# Altium project FPGA_SHIELD_MARK1.PrjPcb
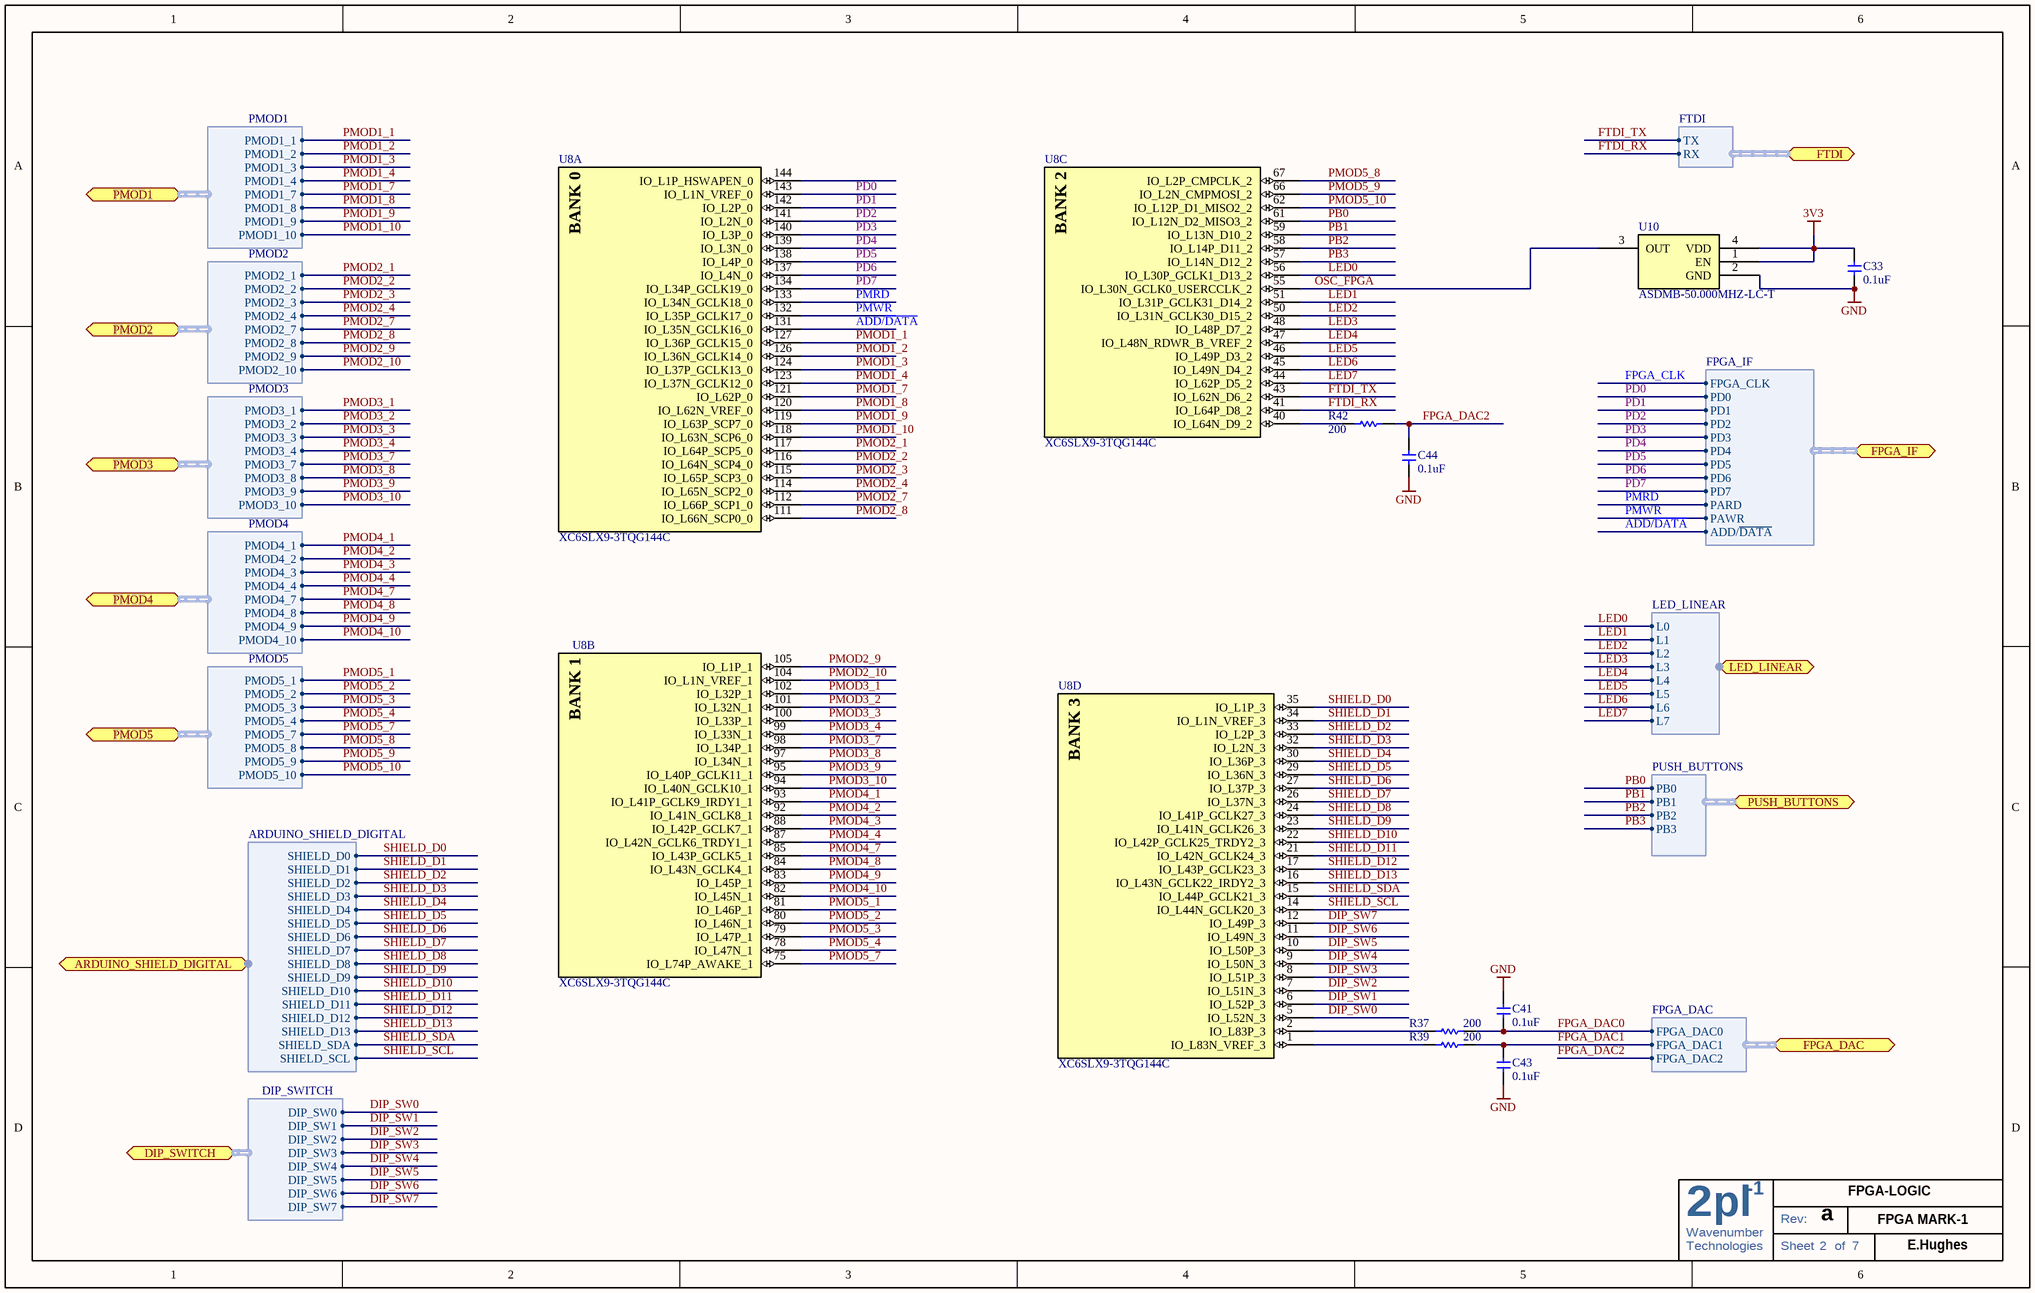
[diagram p0: LOGIC_FPGA.SchDoc]
Engineer: MJ/EH; PCB_TITLE: FPGA Mark 1; PCB_VERSION: a
4 sheets, 60 parts. Net scope: flat (ports and power ports of the same name join across sheets).
Board file: FPGA_SHIELD_MARK1_Single_Side.PcbDoc
Sheets:
  LOGIC_FPGA.SchDoc
  FPGA_POWER_AND_CONFIGURATION.SchDoc
  PMOD_IO.SchDoc
  ARDUINO_IO.SchDoc

## Sheet LOGIC_FPGA.SchDoc: FPGA Logic
size B; Author: Michael Jones; Engineer: Michael Jones; Organization: Group VIII Technology; Address1: 1652 W 820 N; Address2: Provo; Address3: UT  84601; Address4: 801-379-0118; DocumentNumber: 3; Revision: A3; SheetNumber: 2; SheetTotal: 7

### Parts
C33  0.1uF  [C0603]
C41  0.1uF  [C0603]
C43  0.1uF  [C0603]
C44  0.1uF  [C0603]
R37  200  [R0603]
R39  200  [R0603]
R42  200  [R0603]
U8  XC6SLX9-3TQG144C  [TQ144_L]  (parts A,B,C,D of 7)
U10  ASDMB-50.000MHZ-LC-T  [ASDMB - osc]

### Ports
ARDUINO_SHIELD_DIGITAL (harness ARDUINO_SHIELD_DIGITAL), DIP_SWITCH (harness DIP_SWITCH), FPGA_DAC (harness FPGA_DAC), FPGA_IF (harness FPGA_IF), FTDI (harness FTDI), LED_LINEAR (harness LED_LINEAR), PMOD1 (harness PMOD1), PMOD2 (harness PMOD2), PMOD3 (harness PMOD3), PMOD4 (harness PMOD4), PMOD5 (harness PMOD5), PUSH_BUTTONS (harness PUSH_BUTTONS)

### Harnesses
DIP_SWITCH: DIP_SW0, DIP_SW1, DIP_SW2, DIP_SW3, DIP_SW4, DIP_SW5, DIP_SW6, DIP_SW7
ARDUINO_SHIELD_DIGITAL: SHIELD_D13, SHIELD_D12, SHIELD_D11, SHIELD_D10, SHIELD_D9, SHIELD_D8, SHIELD_D7, SHIELD_D6, SHIELD_D5, SHIELD_D4, SHIELD_D3, SHIELD_D2, SHIELD_D1, SHIELD_D0, SHIELD_SDA, SHIELD_SCL
PUSH_BUTTONS: PB0, PB1, PB2, PB3
LED_LINEAR: L0, L1, L2, L3, L4, L5, L6, L7
FPGA_IF: PD0, PD1, PD2, PD3, PD4, PD5, PD6, PD7, PARD, PAWR, ADD/~{DATA}, FPGA_CLK
PMOD1: PMOD1_1, PMOD1_2, PMOD1_3, PMOD1_4, PMOD1_7, PMOD1_8, PMOD1_9, PMOD1_10
PMOD2: PMOD2_1, PMOD2_2, PMOD2_3, PMOD2_4, PMOD2_7, PMOD2_8, PMOD2_9, PMOD2_10
PMOD3: PMOD3_1, PMOD3_2, PMOD3_3, PMOD3_4, PMOD3_7, PMOD3_8, PMOD3_9, PMOD3_10
PMOD4: PMOD4_1, PMOD4_2, PMOD4_3, PMOD4_4, PMOD4_7, PMOD4_8, PMOD4_9, PMOD4_10
PMOD5: PMOD5_1, PMOD5_2, PMOD5_3, PMOD5_4, PMOD5_7, PMOD5_8, PMOD5_9, PMOD5_10
FTDI: TX, RX
FPGA_DAC: FPGA_DAC0, FPGA_DAC1, FPGA_DAC2

### Nets
3V3: C33.2 U10.1(EN) U10.4(VDD)
GND: C33.1 C41.2 C43.2 C44.2 U10.2(GND)
ADD/~{DATA}: U8.131(IO_L35N_GCLK16_0) ; port FPGA_IF.ADD/~{DATA}
DIP_SW0: U8.5(IO_L52N_3) ; port DIP_SWITCH.DIP_SW0
DIP_SW1: U8.6(IO_L52P_3) ; port DIP_SWITCH.DIP_SW1
DIP_SW2: U8.7(IO_L51N_3) ; port DIP_SWITCH.DIP_SW2
DIP_SW3: U8.8(IO_L51P_3) ; port DIP_SWITCH.DIP_SW3
DIP_SW4: U8.9(IO_L50N_3) ; port DIP_SWITCH.DIP_SW4
DIP_SW5: U8.10(IO_L50P_3) ; port DIP_SWITCH.DIP_SW5
DIP_SW6: U8.11(IO_L49N_3) ; port DIP_SWITCH.DIP_SW6
DIP_SW7: U8.12(IO_L49P_3) ; port DIP_SWITCH.DIP_SW7
FPGA_CLK: port FPGA_IF.FPGA_CLK
FPGA_DAC0: C41.1 R37.1 ; port FPGA_DAC.FPGA_DAC0
FPGA_DAC1: C43.1 R39.1 ; port FPGA_DAC.FPGA_DAC1
FPGA_DAC2: C44.1 R42.1 ; port FPGA_DAC.FPGA_DAC2
FTDI_RX: U8.41(IO_L64P_D8_2) ; port FTDI.RX
FTDI_TX: U8.43(IO_L62N_D6_2) ; port FTDI.TX
LED0: U8.56(IO_L30P_GCLK1_D13_2) ; port LED_LINEAR.L0
LED1: U8.51(IO_L31P_GCLK31_D14_2) ; port LED_LINEAR.L1
LED2: U8.50(IO_L31N_GCLK30_D15_2) ; port LED_LINEAR.L2
LED3: U8.48(IO_L48P_D7_2) ; port LED_LINEAR.L3
LED4: U8.47(IO_L48N_RDWR_B_VREF_2) ; port LED_LINEAR.L4
LED5: U8.46(IO_L49P_D3_2) ; port LED_LINEAR.L5
LED6: U8.45(IO_L49N_D4_2) ; port LED_LINEAR.L6
LED7: U8.44(IO_L62P_D5_2) ; port LED_LINEAR.L7
OSC_FPGA: U8.55(IO_L30N_GCLK0_USERCCLK_2) U10.3(OUT)
PB0: U8.61(IO_L12N_D2_MISO3_2) ; port PUSH_BUTTONS.PB0
PB1: U8.59(IO_L13N_D10_2) ; port PUSH_BUTTONS.PB1
PB2: U8.58(IO_L14P_D11_2) ; port PUSH_BUTTONS.PB2
PB3: U8.57(IO_L14N_D12_2) ; port PUSH_BUTTONS.PB3
PD0: U8.143(IO_L1N_VREF_0) ; port FPGA_IF.PD0
PD1: U8.142(IO_L2P_0) ; port FPGA_IF.PD1
PD2: U8.141(IO_L2N_0) ; port FPGA_IF.PD2
PD3: U8.140(IO_L3P_0) ; port FPGA_IF.PD3
PD4: U8.139(IO_L3N_0) ; port FPGA_IF.PD4
PD5: U8.138(IO_L4P_0) ; port FPGA_IF.PD5
PD6: U8.137(IO_L4N_0) ; port FPGA_IF.PD6
PD7: U8.134(IO_L34P_GCLK19_0) ; port FPGA_IF.PD7
PMOD1_1: U8.127(IO_L36P_GCLK15_0) ; port PMOD1.PMOD1_1
PMOD1_2: U8.126(IO_L36N_GCLK14_0) ; port PMOD1.PMOD1_2
PMOD1_3: U8.124(IO_L37P_GCLK13_0) ; port PMOD1.PMOD1_3
PMOD1_4: U8.123(IO_L37N_GCLK12_0) ; port PMOD1.PMOD1_4
PMOD1_7: U8.121(IO_L62P_0) ; port PMOD1.PMOD1_7
PMOD1_8: U8.120(IO_L62N_VREF_0) ; port PMOD1.PMOD1_8
PMOD1_9: U8.119(IO_L63P_SCP7_0) ; port PMOD1.PMOD1_9
PMOD1_10: U8.118(IO_L63N_SCP6_0) ; port PMOD1.PMOD1_10
PMOD2_1: U8.117(IO_L64P_SCP5_0) ; port PMOD2.PMOD2_1
PMOD2_2: U8.116(IO_L64N_SCP4_0) ; port PMOD2.PMOD2_2
PMOD2_3: U8.115(IO_L65P_SCP3_0) ; port PMOD2.PMOD2_3
PMOD2_4: U8.114(IO_L65N_SCP2_0) ; port PMOD2.PMOD2_4
PMOD2_7: U8.112(IO_L66P_SCP1_0) ; port PMOD2.PMOD2_7
PMOD2_8: U8.111(IO_L66N_SCP0_0) ; port PMOD2.PMOD2_8
PMOD2_9: U8.105(IO_L1P_1) ; port PMOD2.PMOD2_9
PMOD2_10: U8.104(IO_L1N_VREF_1) ; port PMOD2.PMOD2_10
PMOD3_1: U8.102(IO_L32P_1) ; port PMOD3.PMOD3_1
PMOD3_2: U8.101(IO_L32N_1) ; port PMOD3.PMOD3_2
PMOD3_3: U8.100(IO_L33P_1) ; port PMOD3.PMOD3_3
PMOD3_4: U8.99(IO_L33N_1) ; port PMOD3.PMOD3_4
PMOD3_7: U8.98(IO_L34P_1) ; port PMOD3.PMOD3_7
PMOD3_8: U8.97(IO_L34N_1) ; port PMOD3.PMOD3_8
PMOD3_9: U8.95(IO_L40P_GCLK11_1) ; port PMOD3.PMOD3_9
PMOD3_10: U8.94(IO_L40N_GCLK10_1) ; port PMOD3.PMOD3_10
PMOD4_1: U8.93(IO_L41P_GCLK9_IRDY1_1) ; port PMOD4.PMOD4_1
PMOD4_2: U8.92(IO_L41N_GCLK8_1) ; port PMOD4.PMOD4_2
PMOD4_3: U8.88(IO_L42P_GCLK7_1) ; port PMOD4.PMOD4_3
PMOD4_4: U8.87(IO_L42N_GCLK6_TRDY1_1) ; port PMOD4.PMOD4_4
PMOD4_7: U8.85(IO_L43P_GCLK5_1) ; port PMOD4.PMOD4_7
PMOD4_8: U8.84(IO_L43N_GCLK4_1) ; port PMOD4.PMOD4_8
PMOD4_9: U8.83(IO_L45P_1) ; port PMOD4.PMOD4_9
PMOD4_10: U8.82(IO_L45N_1) ; port PMOD4.PMOD4_10
PMOD5_1: U8.81(IO_L46P_1) ; port PMOD5.PMOD5_1
PMOD5_2: U8.80(IO_L46N_1) ; port PMOD5.PMOD5_2
PMOD5_3: U8.79(IO_L47P_1) ; port PMOD5.PMOD5_3
PMOD5_4: U8.78(IO_L47N_1) ; port PMOD5.PMOD5_4
PMOD5_7: U8.75(IO_L74P_AWAKE_1) ; port PMOD5.PMOD5_7
PMOD5_8: U8.67(IO_L2P_CMPCLK_2) ; port PMOD5.PMOD5_8
PMOD5_9: U8.66(IO_L2N_CMPMOSI_2) ; port PMOD5.PMOD5_9
PMOD5_10: U8.62(IO_L12P_D1_MISO2_2) ; port PMOD5.PMOD5_10
PMRD: U8.133(IO_L34N_GCLK18_0) ; port FPGA_IF.PARD
PMWR: U8.132(IO_L35P_GCLK17_0) ; port FPGA_IF.PAWR
SHIELD_D0: U8.35(IO_L1P_3) ; port ARDUINO_SHIELD_DIGITAL.SHIELD_D0
SHIELD_D1: U8.34(IO_L1N_VREF_3) ; port ARDUINO_SHIELD_DIGITAL.SHIELD_D1
SHIELD_D2: U8.33(IO_L2P_3) ; port ARDUINO_SHIELD_DIGITAL.SHIELD_D2
SHIELD_D3: U8.32(IO_L2N_3) ; port ARDUINO_SHIELD_DIGITAL.SHIELD_D3
SHIELD_D4: U8.30(IO_L36P_3) ; port ARDUINO_SHIELD_DIGITAL.SHIELD_D4
SHIELD_D5: U8.29(IO_L36N_3) ; port ARDUINO_SHIELD_DIGITAL.SHIELD_D5
SHIELD_D6: U8.27(IO_L37P_3) ; port ARDUINO_SHIELD_DIGITAL.SHIELD_D6
SHIELD_D7: U8.26(IO_L37N_3) ; port ARDUINO_SHIELD_DIGITAL.SHIELD_D7
SHIELD_D8: U8.24(IO_L41P_GCLK27_3) ; port ARDUINO_SHIELD_DIGITAL.SHIELD_D8
SHIELD_D9: U8.23(IO_L41N_GCLK26_3) ; port ARDUINO_SHIELD_DIGITAL.SHIELD_D9
SHIELD_D10: U8.22(IO_L42P_GCLK25_TRDY2_3) ; port ARDUINO_SHIELD_DIGITAL.SHIELD_D10
SHIELD_D11: U8.21(IO_L42N_GCLK24_3) ; port ARDUINO_SHIELD_DIGITAL.SHIELD_D11
SHIELD_D12: U8.17(IO_L43P_GCLK23_3) ; port ARDUINO_SHIELD_DIGITAL.SHIELD_D12
SHIELD_D13: U8.16(IO_L43N_GCLK22_IRDY2_3) ; port ARDUINO_SHIELD_DIGITAL.SHIELD_D13
SHIELD_SCL: U8.14(IO_L44N_GCLK20_3) ; port ARDUINO_SHIELD_DIGITAL.SHIELD_SCL
SHIELD_SDA: U8.15(IO_L44P_GCLK21_3) ; port ARDUINO_SHIELD_DIGITAL.SHIELD_SDA
NetR37_2: R37.2 U8.2(IO_L83P_3)
NetR39_2: R39.2 U8.1(IO_L83N_VREF_3)
NetR42_2: R42.2 U8.40(IO_L64N_D9_2)

Not connected (* = marked no-connect by the designer): U8 144(IO_L1P_HSWAPEN_0)

### Notes on the sheet
- a
- FPGA-LOGIC
- FPGA MARK-1
- E.Hughes
- 2
- Wavenumber
- pl
- -1
- Rev:
- Technologies
- Sheet
- of
- (in symbol XC6SLX9-3TQG144C, part A) BANK 0
- (in symbol XC6SLX9-3TQG144C, part B) BANK 1
- (in symbol XC6SLX9-3TQG144C, part C) BANK 2
- (in symbol XC6SLX9-3TQG144C, part D) BANK 3

### Library data of the parts
C33 C41 C43 C44 = GRM188R71H104KA93D: CAP CER .1UF 50V 10% X7R 0603; Manufacturer: Murata Electronics North America; Capacitance: 0.1µF; Manufacturer Part Number: GRM188R71H104KA93D; Supplier 1: Digi-Key; Supplier Part Number 1: 490-1519-1-ND; RoHS: RoHS Compliant; Category: Capacitors; Pricing 1: 10=0.037, 100=0.0221, 500=0.01276, 1000=0.00884 (USD); Voltage - Rated: 50V; Tolerance: ±10%; Temperature Coefficient: X7R; Mounting Type: Surface Mount, MLCC; Operating Temperature: -55°C ~ 125°C; Features: -; Applications: General Purpose; Ratings: -; Package / Case: 0603 (1608 Metric); Size / Dimension: 0.063" L x 0.031" W (1.60mm x 0.80mm); Lead Spacing: -; Thickness: 0.80mm; Packaging: Cut Tape (CT); Lead Style: -; ComponentLink1URL: http://search.murata.co.jp/Ceramy/image/img/PDF/ENG/GRM188R71H104KA93.pdf; ComponentLink1Description: http://search.murata.co.jp/Ceramy/image/img/PDF/ENG/GRM188R71H104KA93.pdf
  C33: Value: CAP CER .1UF 50V 10% X7R 0603; Stock 1: 9370695
  C41 C43 C44: Value: 0.1uF; Stock 1: 6315460
R37 R39 R42 = ERJ-3EKF2000V: RES 200 OHM 1/10W 1% 0603 SMD; Manufacturer: Panasonic - ECG; Power (Watts): 0.1W, 1/10W; Temperature Coefficient: ±100ppm/°C; Value: RES 200 OHM 1/10W 1% 0603 SMD; Supplier 1: Digi-Key; Supplier Part Number 1: P200HCT-ND; Manufacturer Part Number: ERJ-3EKF2000V; RoHS: RoHS Compliant; Category: Resistors; Stock 1: 1279595; Pricing 1: 1=0.04, 50=0.015, 100=0.0114, 250=0.00844, 500=0.00624, 1000=0.00416 (USD); Resistance (Ohms): 200; Composition: Thick Film; Features: -; Tolerance: ±1%; Size / Dimension: 0.063" L x 0.031" W (1.60mm x 0.80mm); Height: 0.018" (0.45mm); Lead Style: Surface Mount (SMD - SMT); Packaging: Cut Tape (CT); Package / Case: 0603 (1608 Metric); ComponentLink1URL: http://industrial.panasonic.com/www-cgi/jvcr13pz.cgi?E+PZ+3+AOA0002+ERJ3EKF2000V+7+WW; ComponentLink1Description: http://industrial.panasonic.com/www-cgi/jvcr13pz.cgi?E+PZ+3+AOA0002+ERJ3EKF2000V+7+WW
U8 = XC6SLX9-3TQG144C: IC FPAG SPARTAN 6 9K 144TQFP; Manufacturer: Xilinx Inc; Number of Logic Elements/Cells: 9152; Number of LABs/CLBs: 715; Total RAM Bits: 589824; Number of I /O: 102; Voltage - Supply: 1.14 V ~ 1.26 V; Supplier 1: Digi-Key; Supplier Part Number 1: 122-1747-ND; Manufacturer Part Number: XC6SLX9-3TQG144C; RoHS: RoHS Compliant; Category: Integrated Circuits (ICs); Stock 1: 77; Pricing 1: 1=17.22 (USD); Number of Gates: -; Mounting Type: Surface Mount; Operating Temperature: 0°C ~ 85°C; Package / Case: 144-LQFP; Supplier Device Package: 144-TQFP (20x20); ComponentLink1URL: http://www.xilinx.com/support/documentation/data_sheets/ds160.pdf; ComponentLink1Description: http://www.xilinx.com/support/documentation/data_sheets/ds160.pdf; Value: XC6SLX9-3TQG144C
U10 = ASDMB-50.000MHZ-LC-T: OSC MEMS 50.000 MHZ SMD; Manufacturer: Abracon Corporation; Frequency: 50MHz; Function: Tri-State (Output Enable); Output: CMOS; Voltage - Supply: 1.8 V ~ 3.3 V; Frequency Stability: ±50ppm; Current - Supply (Max): 16mA; Current - Supply (Disable) (Max): 15µA; Supplier 1: Digi-Key; Manufacturer Part Number: ASDMB-50.000MHZ-LC-T; RoHS: RoHS Compliant; Category: Crystals and Oscillators; Stock 1: 967; Pricing 1: 1=1.69, 10=1.463, 50=1.2826, 100=1.0125, 500=0.855 (USD); Type: MEMS (Silicon); Operating Temperature: -40°C ~ 85°C; Mounting Type: Surface Mount; Size / Dimension: 0.098" L x 0.079" W (2.50mm x 2.00mm); Height: 0.035" (0.90mm); Package / Case: 4-SMD, No Lead (DFN, LCC); Packaging: Cut Tape (CT); ComponentLink1URL: http://www.abracon.com/Oscillators/ASDMB.pdf; ComponentLink1Description: http://www.abracon.com/Oscillators/ASDMB.pdf; Supplier Part Number 1: 535-11738-1-ND; Value: ASDMB-50.000MHZ-LC-T

## Sheet FPGA_POWER_AND_CONFIGURATION.SchDoc: FPGA Power and Configuration
size B; Author: Michael Jones; Engineer: Michael Jones; Organization: Group VIII Technology; Address1: 1652 W 820 N; Address2: Provo; Address3: UT  84601; Address4: 801-379-0118; DocumentNumber: 4; Revision: A3; SheetNumber: 3; SheetTotal: 7
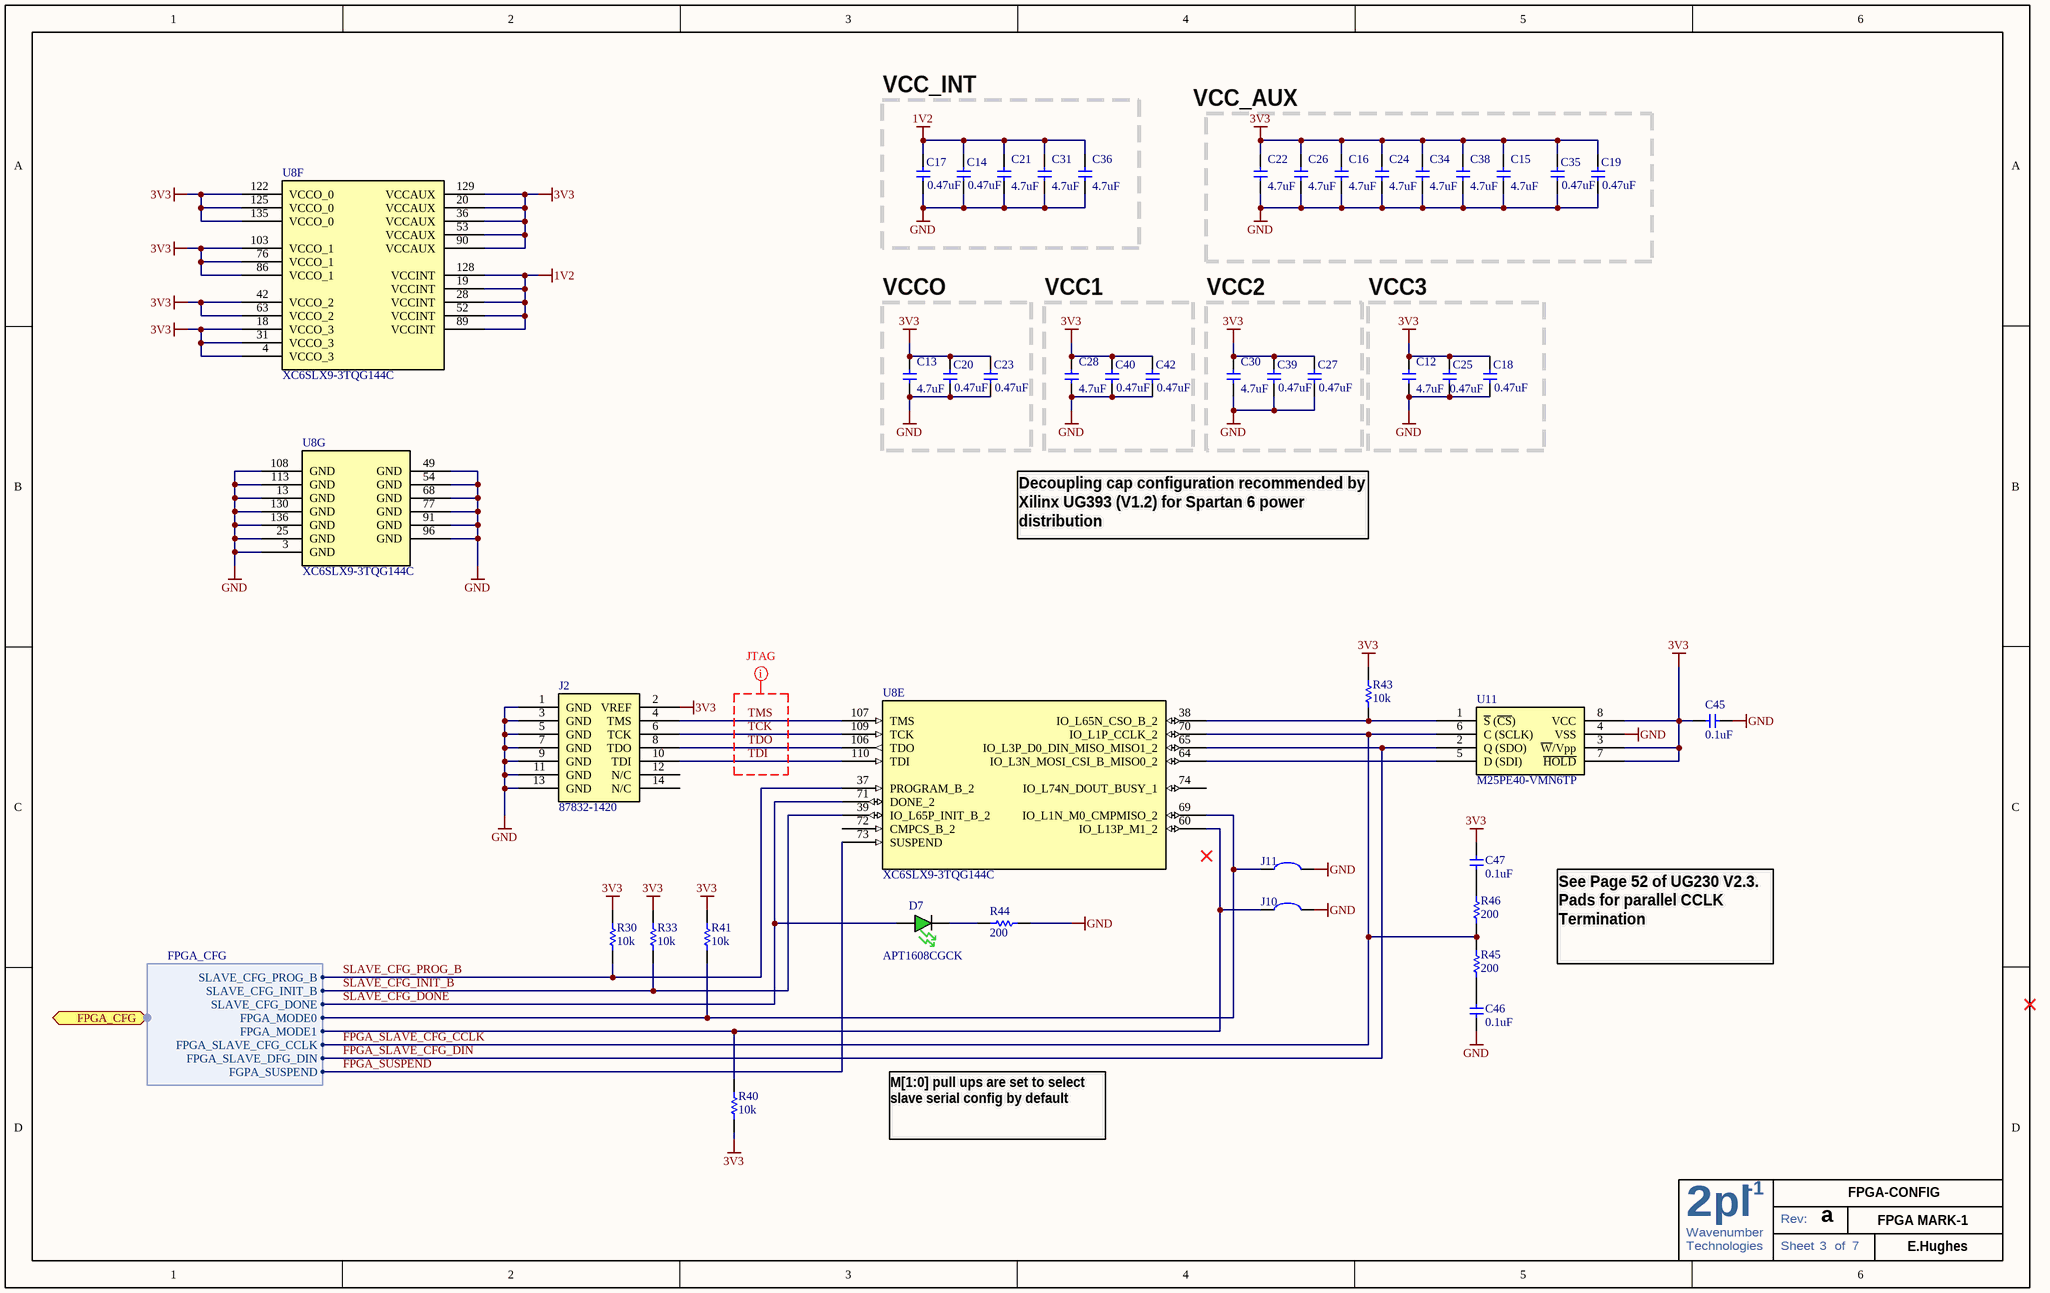
[diagram p1: FPGA_POWER_AND_CONFIGURATION.SchDoc]

### Parts
C12  4.7uF  [C0603]
C13  4.7uF  [C0603]
C14  0.47uF  [C0603]
C15  4.7uF  [C0603]
C16  4.7uF  [C0603]
C17  0.47uF  [C0603]
C18  0.47uF  [C0603]
C19  0.47uF  [C0603]
C20  0.47uF  [C0603]
C21  4.7uF  [C0603]
C22  4.7uF  [C0603]
C23  0.47uF  [C0603]
C24  4.7uF  [C0603]
C25  0.47uF  [C0603]
C26  4.7uF  [C0603]
C27  0.47uF  [C0603]
C28  4.7uF  [C0603]
C30  4.7uF  [C0603]
C31  4.7uF  [C0603]
C34  4.7uF  [C0603]
C35  0.47uF  [C0603]
C36  4.7uF  [C0603]
C38  4.7uF  [C0603]
C39  0.47uF  [C0603]
C40  0.47uF  [C0603]
C42  0.47uF  [C0603]
C45  0.1uF  [C0603]
C46  0.1uF  [C0603]
C47  0.1uF  [C0603]
D7  APT1608CGCK  [LED_0603 - GREEN]
J2  87832-1420  [87832-1420]
J10  Solder Jumper  [SOLDER_JUMPER]  (value not drawn)  (no BOM)
J11  Solder Jumper  [SOLDER_JUMPER]  (value not drawn)  (no BOM)
R30  10k  [R0603]
R33  10k  [R0603]
R40  10k  [R0603]
R41  10k  [R0603]
R43  10k  [R0603]
R44  200  [R0603]
R45  200  [R0603]
R46  200  [R0603]
U8  XC6SLX9-3TQG144C  [TQ144_L]  (parts E,F,G of 7)
U11  M25PE40-VMN6TP  [SOIC 8]

### Blocks framed on the sheet
VCC_INT: C14 C17 C21 C31 C36
VCCO: C13 C20 C23
VCC1: C28 C40 C42
VCC2: C27 C30 C39
VCC3: C12 C18 C25

### Ports
FPGA_CFG (harness FPGA_CFG)

### Harnesses
FPGA_CFG: SLAVE_CFG_PROG_B, SLAVE_CFG_INIT_B, SLAVE_CFG_DONE, FPGA_MODE0, FPGA_MODE1, FPGA_SLAVE_CFG_CCLK, FPGA_SLAVE_DFG_DIN, FGPA_SUSPEND

### Nets
1V2: C14.2 C17.2 C21.2 C31.2 C36.2 U8.19(VCCINT) U8.28(VCCINT) U8.52(VCCINT) U8.89(VCCINT) U8.128(VCCINT)
3V3: C12.2 C13.2 C15.2 C16.2 C18.2 C19.2 C20.2 C22.2 C23.2 C24.2 C25.2 C26.2 C27.2 C28.2 C30.2 C34.2 C35.2 C38.2 C39.2 C40.2 C42.2 C45.1 C47.2 J2.2(VREF) R30.2 R33.2 R40.1 R41.2 R43.2 U8.4(VCCO_3) U8.18(VCCO_3) U8.20(VCCAUX) U8.31(VCCO_3) U8.36(VCCAUX) U8.42(VCCO_2) U8.53(VCCAUX) U8.63(VCCO_2) U8.76(VCCO_1) U8.86(VCCO_1) U8.90(VCCAUX) U8.103(VCCO_1) U8.122(VCCO_0) U8.125(VCCO_0) U8.129(VCCAUX) U8.135(VCCO_0) U11.3(~{W}/Vpp) U11.7(~{HOLD}) U11.8(VCC)
GND: C12.1 C13.1 C14.1 C15.1 C16.1 C17.1 C18.1 C19.1 C20.1 C21.1 C22.1 C23.1 C24.1 C25.1 C26.1 C27.1 C28.1 C30.1 C31.1 C34.1 C35.1 C36.1 C38.1 C39.1 C40.1 C42.1 C45.2 C46.1 J2.1(GND) J2.3(GND) J2.5(GND) J2.7(GND) J2.9(GND) J2.11(GND) J2.13(GND) J10.2 J11.2 R44.2 U8.3(GND) U8.13(GND) U8.25(GND) U8.49(GND) U8.54(GND) U8.68(GND) U8.77(GND) U8.91(GND) U8.96(GND) U8.108(GND) U8.113(GND) U8.130(GND) U8.136(GND) U11.4(VSS)
FPGA_SLAVE_CFG_CCLK: R45.2 R46.1 U8.70(IO_L1P_CCLK_2) U11.6(C_(SCLK)) ; port FPGA_CFG.FPGA_SLAVE_CFG_CCLK
FPGA_SLAVE_CFG_DIN: U8.65(IO_L3P_D0_DIN_MISO_MISO1_2) U11.2(Q_(SDO)) ; port FPGA_CFG.FPGA_SLAVE_DFG_DIN
FPGA_SUSPEND: U8.73(SUSPEND) ; port FPGA_CFG.FGPA_SUSPEND
SLAVE_CFG_DONE: D7.A U8.71(DONE_2) ; port FPGA_CFG.SLAVE_CFG_DONE
SLAVE_CFG_INIT_B: R33.1 U8.39(IO_L65P_INIT_B_2) ; port FPGA_CFG.SLAVE_CFG_INIT_B
SLAVE_CFG_PROG_B: R30.1 U8.37(PROGRAM_B_2) ; port FPGA_CFG.SLAVE_CFG_PROG_B
TCK: J2.6(TCK) U8.109(TCK)
TDI: J2.10(TDI) U8.110(TDI)
TDO: J2.8(TDO) U8.106(TDO)
TMS: J2.4(TMS) U8.107(TMS)
NetC46_2: C46.2 R45.1
NetC47_1: C47.1 R46.2
NetD7_C: D7.C R44.1
NetJ10_1: J10.1 R40.2 U8.60(IO_L13P_M1_2) ; port FPGA_CFG.FPGA_MODE1
NetJ11_1: J11.1 R41.1 U8.69(IO_L1N_M0_CMPMISO_2) ; port FPGA_CFG.FPGA_MODE0
NetR43_1: R43.1 U8.38(IO_L65N_CSO_B_2) U11.1(~{S}_(~{CS}))
NetU8_64: U8.64(IO_L3N_MOSI_CSI_B_MISO0_2) U11.5(D_(SDI))

Not connected (* = marked no-connect by the designer): J2 12(N/C) 14(N/C); U8 72(CMPCS_B_2) 74(IO_L74N_DOUT_BUSY_1)

### Layout directives
net class JTAG: TCK, TDI, TDO, TMS

### Notes on the sheet
- VCC_AUX
- Decoupling cap configuration recommended by Xilinx UG393 (V1.2) for Spartan 6 power distribution
- See Page 52 of UG230 V2.3.   Pads for parallel CCLK Termination
- M[1:0] pull ups are set to select slave serial config by default
- a
- FPGA-CONFIG
- FPGA MARK-1
- E.Hughes
- 2
- Wavenumber
- pl
- -1
- Rev:
- Technologies
- Sheet
- of

### Library data of the parts
C12 C13 C15 C16 C21 C22 C24 C26 C28 C30 C31 C34 C36 C38 = GRM188R60J475KE19D: CAP CER 4.7UF 6.3V X5R 0603; Manufacturer: Murata Electronics North America; Capacitance: 4.7µF; Tolerance: ±10%; Supplier 1: Digi-Key; Supplier Part Number 1: 490-3297-1-ND; Manufacturer Part Number: GRM188R60J475KE19D; RoHS: RoHS Compliant; Category: Capacitors; Stock 1: 714091; Pricing 1: 10=0.214, 50=0.148, 100=0.1142, 250=0.08204, 500=0.0585, 1000=0.04281 (USD); Voltage - Rated: 6.3V; Temperature Coefficient: X5R; Mounting Type: Surface Mount, MLCC; Operating Temperature: -55°C ~ 85°C; Applications: General Purpose; Ratings: -; Package / Case: 0603 (1608 Metric); Size / Dimension: 0.063" L x 0.031" W (1.60mm x 0.80mm); Height: -; Thickness: 0.035" (0.90mm); Lead Spacing: -; Features: -; Packaging: Cut Tape (CT); Lead Style: -; ComponentLink1URL: http://search.murata.co.jp/Ceramy/image/img/PDF/ENG/GRM188R60J475KE19.pdf; ComponentLink1Description: http://search.murata.co.jp/Ceramy/image/img/PDF/ENG/GRM188R60J475KE19.pdf; Value: 4.7uF
C14 C17-C20 C23 C25 C27 C35 C39 C40 C42 = GCM188R71E474KA64D: CAP CER .47UF 25V X7R 0603; Manufacturer: Murata Electronics North America; Capacitance: 0.47µF; Tolerance: ±10%; Supplier 1: Digi-Key; Supplier Part Number 1: 490-4776-1-ND; Manufacturer Part Number: GCM188R71E474KA64D; RoHS: RoHS Compliant; Category: Capacitors; Stock 1: 120782; Pricing 1: 10=0.248, 50=0.1444, 100=0.1155, 250=0.08252, 500=0.0561, 1000=0.04538 (USD); Voltage - Rated: 25V; Temperature Coefficient: X7R; Mounting Type: Surface Mount, MLCC; Operating Temperature: -55°C ~ 125°C; Applications: Automotive; Ratings: AEC-Q200; Package / Case: 0603 (1608 Metric); Size / Dimension: 0.063" L x 0.031" W (1.60mm x 0.80mm); Height: -; Thickness: 0.035" (0.90mm); Lead Spacing: -; Features: -; Packaging: Cut Tape (CT); Lead Style: -; ComponentLink1URL: http://search.murata.co.jp/Ceramy/image/img/PDF/ENG/GCM188R71E474KA64.pdf; ComponentLink1Description: http://search.murata.co.jp/Ceramy/image/img/PDF/ENG/GCM188R71E474KA64.pdf; Value: 0.47uF
C45-C47 = GRM188R71H104KA93D: as C33 on sheet LOGIC_FPGA; Manufacturer Part Number: GRM188R71H104KA93D; Value: CAP CER .1UF 50V 10% X7R 0603; Supplier 1: Digi-Key; Supplier Part Number 1: 490-1519-1-ND; RoHS: RoHS Compliant; Category: Capacitors; Stock 1: 9370695; Pricing 1: 10=0.037, 100=0.0221, 500=0.01276, 1000=0.00884 (USD); Voltage - Rated: 50V; Tolerance: ±10%; Temperature Coefficient: X7R; Mounting Type: Surface Mount, MLCC; Operating Temperature: -55°C ~ 125°C; Features: -; Applications: General Purpose; Ratings: -; Package / Case: 0603 (1608 Metric); Size / Dimension: 0.063" L x 0.031" W (1.60mm x 0.80mm); Lead Spacing: -; Thickness: 0.80mm; Packaging: Cut Tape (CT); Lead Style: -; ComponentLink1URL: http://search.murata.co.jp/Ceramy/image/img/PDF/ENG/GRM188R71H104KA93.pdf; ComponentLink1Description: http://search.murata.co.jp/Ceramy/image/img/PDF/ENG/GRM188R71H104KA93.pdf
D7 = APT1608CGCK: LED 1.6X0.8MM 570NM GRN CLR SMD; Manufacturer: Kingbright Corp; Color: Green; Current - Test: 20mA; Wavelength - Peak: 574nm; Millicandela Rating: 50mcd; Voltage - Forward (Vf) Typ: 2.1V; Lens Type: Clear; Lens Style/Size: Rectangle, 1.2mm x 0.8mm; Viewing Angle: 120°; Value: APT1608CGCK; Supplier 1: Digi-Key; Supplier Part Number 1: 754-1116-2-ND; Manufacturer Part Number: APT1608CGCK; RoHS: RoHS Compliant; Category: Optoelectronics; Stock 1: 94000; Pricing 1: 2000=0.051, 6000=0.045, 10000=0.043 (USD); Luminous Flux @ Current - Test: -; Wavelength - Dominant: 570nm; Size / Dimension: 1.60mm L x 0.80mm W; Height: 0.75mm; Package / Case: 0603 (1608 Metric); Mounting Type: Surface Mount; Packaging: Tape & Reel (TR); ComponentLink1URL: http://www.us.kingbright.com/images/catalog/SPEC/APT1608CGCK.pdf; ComponentLink1Description: http://www.us.kingbright.com/images/catalog/SPEC/APT1608CGCK.pdf
J2 = XILINX_JTAG: CONN HEADER 14POS 2MM VERT SMD; Manufacturer: Molex Connector Corporation; Source Part Number: WM18641-ND; Manufacturer Part Number: 87832-1420; Source: Digikey; Value: CONN HEADER 14POS 2MM VERT SMD; ROHS Certificate: *
J10 J11 = Solder Jumper: Solder/Configuration Jumper; Manufacturer: n/a; Manufacturer Part Number: n/a; Source: n/a; Source Part Number: n/a; ROHS Certificate: n/a
R30 R33 R40 R41 R43 = ERJ-3EKF1002V: RES 10.0K OHM 1/10W 1% 0603 SMD; Manufacturer: Panasonic - ECG; Power (Watts): 0.1W, 1/10W; Temperature Coefficient: ±100ppm/°C; Manufacturer Part Number: ERJ-3EKF1002V; Value: 10k; Supplier 1: Digi-Key; RoHS: RoHS Compliant; Category: Resistors; Stock 1: 11168880; Pricing 1: 1=0.04, 50=0.015, 100=0.0114, 250=0.00844, 500=0.00624, 1000=0.00416 (USD); Resistance (Ohms): 10.0K; Composition: Thick Film; Features: -; Tolerance: ±1%; Size / Dimension: 0.063" L x 0.031" W (1.60mm x 0.80mm); Height: 0.018" (0.45mm); Lead Style: Surface Mount (SMD - SMT); Packaging: Cut Tape (CT); Package / Case: 0603 (1608 Metric); ComponentLink1URL: http://industrial.panasonic.com/www-cgi/jvcr13pz.cgi?E+PZ+3+AOA0002+ERJ3EKF1002V+7+WW; ComponentLink1Description: http://industrial.panasonic.com/www-cgi/jvcr13pz.cgi?E+PZ+3+AOA0002+ERJ3EKF1002V+7+WW; Supplier Part Number 1: P10.0KHCT-ND
R44-R46 = ERJ-3EKF2000V: as R37 on sheet LOGIC_FPGA; Manufacturer Part Number: ERJ-3EKF2000V; Value: RES 200 OHM 1/10W 1% 0603 SMD; Supplier 1: Digi-Key; Supplier Part Number 1: P200HCT-ND; RoHS: RoHS Compliant; Category: Resistors; Stock 1: 1279595; Pricing 1: 1=0.04, 50=0.015, 100=0.0114, 250=0.00844, 500=0.00624, 1000=0.00416 (USD); Resistance (Ohms): 200; Composition: Thick Film; Features: -; Tolerance: ±1%; Size / Dimension: 0.063" L x 0.031" W (1.60mm x 0.80mm); Height: 0.018" (0.45mm); Lead Style: Surface Mount (SMD - SMT); Packaging: Cut Tape (CT); Package / Case: 0603 (1608 Metric); ComponentLink1URL: http://industrial.panasonic.com/www-cgi/jvcr13pz.cgi?E+PZ+3+AOA0002+ERJ3EKF2000V+7+WW; ComponentLink1Description: http://industrial.panasonic.com/www-cgi/jvcr13pz.cgi?E+PZ+3+AOA0002+ERJ3EKF2000V+7+WW
U8 = XC6SLX9-3TQG144C: as U8 on sheet LOGIC_FPGA; Supplier 1: Digi-Key; Supplier Part Number 1: 122-1747-ND; Manufacturer Part Number: XC6SLX9-3TQG144C; RoHS: RoHS Compliant; Category: Integrated Circuits (ICs); Stock 1: 77; Pricing 1: 1=17.22 (USD); Number of Gates: -; Mounting Type: Surface Mount; Operating Temperature: 0°C ~ 85°C; Package / Case: 144-LQFP; Supplier Device Package: 144-TQFP (20x20); ComponentLink1URL: http://www.xilinx.com/support/documentation/data_sheets/ds160.pdf; ComponentLink1Description: http://www.xilinx.com/support/documentation/data_sheets/ds160.pdf; Value: XC6SLX9-3TQG144C
U11 = M25PE40-VMN6TP: IC FLASH 4MBIT 75MHZ 8SOIC; Manufacturer: Numonyx - A DIVISION OF MICRON SEMICONDUCTOR PRODUCTS, INC.; Memory Size: 4M (512K x 8); Interface: SPI, 3-Wire Serial; Voltage - Supply: 2.7 V ~ 3.6 V; Supplier 1: Digi-Key; Supplier Part Number 1: M25PE40-VMN6TPCT-ND; Manufacturer Part Number: M25PE40-VMN6TP; RoHS: RoHS Compliant; Category: Integrated Circuits (ICs); Pricing 1: 1=1.86, 10=1.666, 25=1.47, 100=1.323, 250=1.15152, 500=1.029, 1000=0.8085 (USD); Format - Memory: FLASH; Memory Type: FLASH; Speed: 75MHz; Operating Temperature: -40°C ~ 85°C; Package / Case: 8-SOIC (0.154", 3.90mm Width); Supplier Device Package: 8-SO; Packaging: Cut Tape (CT); ComponentLink1URL: http://media.digikey.com/pdf/Data%20Sheets/Micron%20Technology%20Inc%20PDFs/M25PE40.pdf; ComponentLink1Description: http://media.digikey.com/pdf/Data%20Sheets/Micron%20Technology%20Inc%20PDFs/M25PE40.pdf; Stock 1: 1941; Value: M25PE40-VMN6TP

## Sheet PMOD_IO.SchDoc
size B; Organization: Altium Limited; Address1: 3 Minna Close; Address2: Belrose; Address3: NSW 2085; Address4: Australia; SheetNumber: 6; SheetTotal: 7
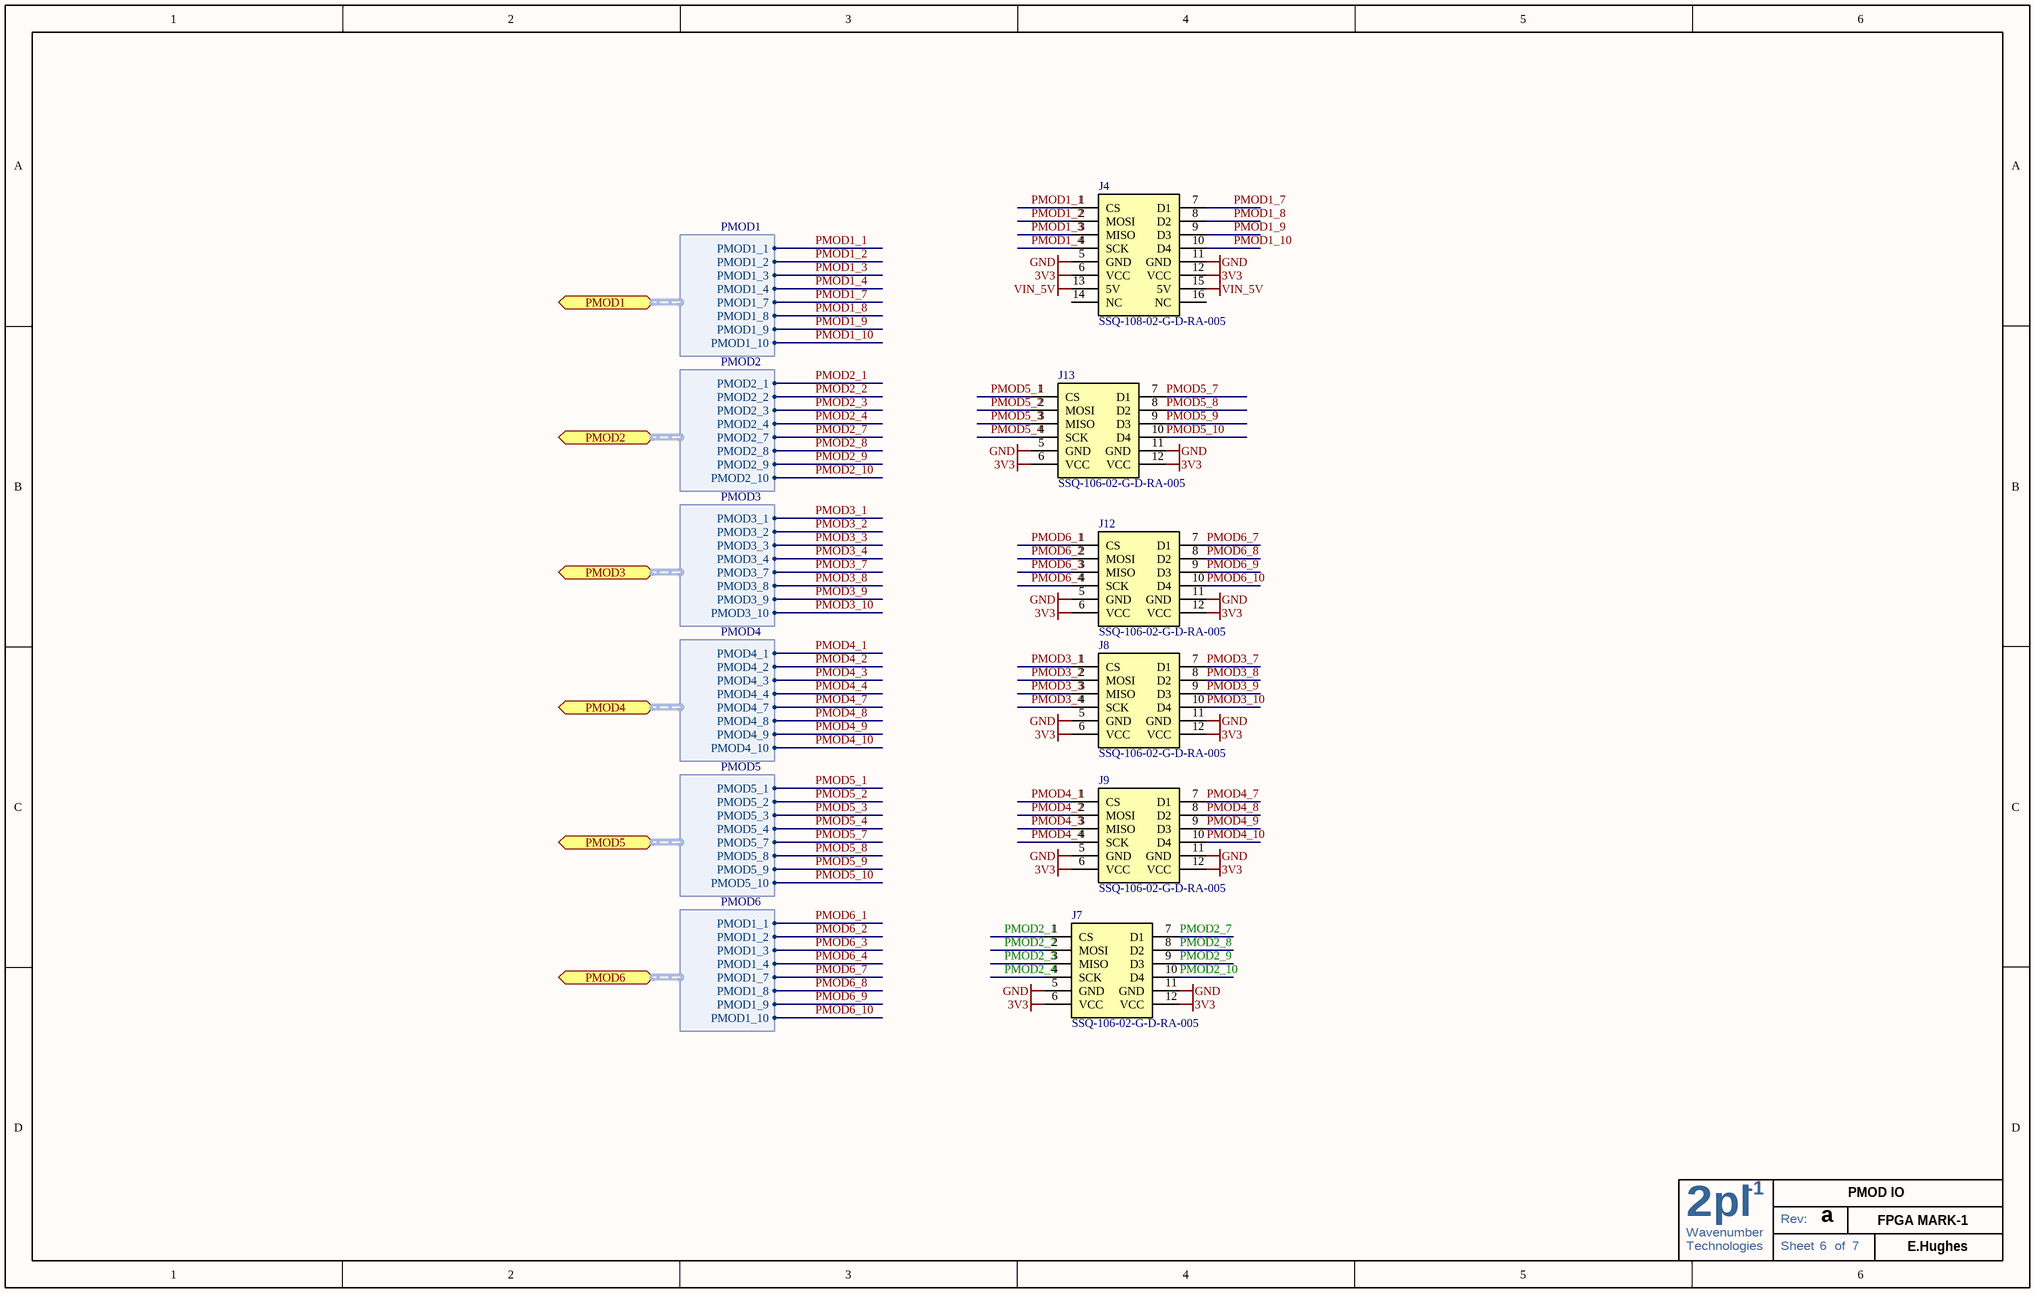
[diagram p2: PMOD_IO.SchDoc]

### Parts
J4  SSQ-108-02-G-D-RA-005  [PMOD HEADER8 - SSQ-108-02-G-D-RA]
J7  SSQ-106-02-G-D-RA-005  [PMOD HEADER - SSQ-106-02-G-D-RA]
J8  SSQ-106-02-G-D-RA-005  [PMOD HEADER - SSQ-106-02-G-D-RA]
J9  SSQ-106-02-G-D-RA-005  [PMOD HEADER - SSQ-106-02-G-D-RA]
J12  SSQ-106-02-G-D-RA-005  [PMOD HEADER - SSQ-106-02-G-D-RA]
J13  SSQ-106-02-G-D-RA-005  [PMOD HEADER - SSQ-106-02-G-D-RA]

### Ports
PMOD1 (harness PMOD1), PMOD2 (harness PMOD2), PMOD3 (harness PMOD3), PMOD4 (harness PMOD4), PMOD5 (harness PMOD5), PMOD6 (harness PMOD6)

### Harnesses
PMOD1: PMOD1_1, PMOD1_2, PMOD1_3, PMOD1_4, PMOD1_7, PMOD1_8, PMOD1_9, PMOD1_10
PMOD2: PMOD2_1, PMOD2_2, PMOD2_3, PMOD2_4, PMOD2_7, PMOD2_8, PMOD2_9, PMOD2_10
PMOD3: PMOD3_1, PMOD3_2, PMOD3_3, PMOD3_4, PMOD3_7, PMOD3_8, PMOD3_9, PMOD3_10
PMOD4: PMOD4_1, PMOD4_2, PMOD4_3, PMOD4_4, PMOD4_7, PMOD4_8, PMOD4_9, PMOD4_10
PMOD5: PMOD5_1, PMOD5_2, PMOD5_3, PMOD5_4, PMOD5_7, PMOD5_8, PMOD5_9, PMOD5_10
PMOD6: PMOD1_1, PMOD1_2, PMOD1_3, PMOD1_4, PMOD1_7, PMOD1_8, PMOD1_9, PMOD1_10

### Nets
3V3: J4.6(VCC) J4.12(VCC) J7.6(VCC) J7.12(VCC) J8.6(VCC) J8.12(VCC) J9.6(VCC) J9.12(VCC) J12.6(VCC) J12.12(VCC) J13.6(VCC) J13.12(VCC)
GND: J4.5(GND) J4.11(GND) J7.5(GND) J7.11(GND) J8.5(GND) J8.11(GND) J9.5(GND) J9.11(GND) J12.5(GND) J12.11(GND) J13.5(GND) J13.11(GND)
VIN_5V: J4.13(5V) J4.15(5V)
PMOD1_1: J4.1(CS) ; port PMOD1.PMOD1_1
PMOD1_2: J4.2(MOSI) ; port PMOD1.PMOD1_2
PMOD1_3: J4.3(MISO) ; port PMOD1.PMOD1_3
PMOD1_4: J4.4(SCK) ; port PMOD1.PMOD1_4
PMOD1_7: J4.7(D1) ; port PMOD1.PMOD1_7
PMOD1_8: J4.8(D2) ; port PMOD1.PMOD1_8
PMOD1_9: J4.9(D3) ; port PMOD1.PMOD1_9
PMOD1_10: J4.10(D4) ; port PMOD1.PMOD1_10
PMOD2_1: J7.1(CS) ; port PMOD2.PMOD2_1
PMOD2_2: J7.2(MOSI) ; port PMOD2.PMOD2_2
PMOD2_3: J7.3(MISO) ; port PMOD2.PMOD2_3
PMOD2_4: J7.4(SCK) ; port PMOD2.PMOD2_4
PMOD2_7: J7.7(D1) ; port PMOD2.PMOD2_7
PMOD2_8: J7.8(D2) ; port PMOD2.PMOD2_8
PMOD2_9: J7.9(D3) ; port PMOD2.PMOD2_9
PMOD2_10: J7.10(D4) ; port PMOD2.PMOD2_10
PMOD3_1: J8.1(CS) ; port PMOD3.PMOD3_1
PMOD3_2: J8.2(MOSI) ; port PMOD3.PMOD3_2
PMOD3_3: J8.3(MISO) ; port PMOD3.PMOD3_3
PMOD3_4: J8.4(SCK) ; port PMOD3.PMOD3_4
PMOD3_7: J8.7(D1) ; port PMOD3.PMOD3_7
PMOD3_8: J8.8(D2) ; port PMOD3.PMOD3_8
PMOD3_9: J8.9(D3) ; port PMOD3.PMOD3_9
PMOD3_10: J8.10(D4) ; port PMOD3.PMOD3_10
PMOD4_1: J9.1(CS) ; port PMOD4.PMOD4_1
PMOD4_2: J9.2(MOSI) ; port PMOD4.PMOD4_2
PMOD4_3: J9.3(MISO) ; port PMOD4.PMOD4_3
PMOD4_4: J9.4(SCK) ; port PMOD4.PMOD4_4
PMOD4_7: J9.7(D1) ; port PMOD4.PMOD4_7
PMOD4_8: J9.8(D2) ; port PMOD4.PMOD4_8
PMOD4_9: J9.9(D3) ; port PMOD4.PMOD4_9
PMOD4_10: J9.10(D4) ; port PMOD4.PMOD4_10
PMOD5_1: J13.1(CS) ; port PMOD5.PMOD5_1
PMOD5_2: J13.2(MOSI) ; port PMOD5.PMOD5_2
PMOD5_3: J13.3(MISO) ; port PMOD5.PMOD5_3
PMOD5_4: J13.4(SCK) ; port PMOD5.PMOD5_4
PMOD5_7: J13.7(D1) ; port PMOD5.PMOD5_7
PMOD5_8: J13.8(D2) ; port PMOD5.PMOD5_8
PMOD5_9: J13.9(D3) ; port PMOD5.PMOD5_9
PMOD5_10: J13.10(D4) ; port PMOD5.PMOD5_10
PMOD6_1: J12.1(CS) ; port PMOD6.PMOD1_1
PMOD6_2: J12.2(MOSI) ; port PMOD6.PMOD1_2
PMOD6_3: J12.3(MISO) ; port PMOD6.PMOD1_3
PMOD6_4: J12.4(SCK) ; port PMOD6.PMOD1_4
PMOD6_7: J12.7(D1) ; port PMOD6.PMOD1_7
PMOD6_8: J12.8(D2) ; port PMOD6.PMOD1_8
PMOD6_9: J12.9(D3) ; port PMOD6.PMOD1_9
PMOD6_10: J12.10(D4) ; port PMOD6.PMOD1_10

Not connected (* = marked no-connect by the designer): J4 14(NC) 16(NC)

### Notes on the sheet
- a
- PMOD IO
- FPGA MARK-1
- E.Hughes
- 2
- Wavenumber
- pl
- -1
- Rev:
- Technologies
- Sheet
- of

### Library data of the parts
J4 = P-MOD - SSQ-108-02-G-D-RA-005: SAMTEC - SSQ-108-02-G-D-RA-005 - 2MM SOCKET STRIPS; Supplier 1: Newark; Supplier Part Number 1: 81P8253; Manufacturer: SAMTEC; Manufacturer Part Number: SSQ-108-02-G-D-RA-005; Stock 1: 0; Pricing 1: 1=1.58, 20834=1.4, 41667=1.32 (USD); Value: SSQ-108-02-G-D-RA-005
J7-J9 J12 J13 = P-MOD - SSQ-106-02-G-D-RA-005: SAMTEC - SSQ-106-02-G-D-RA-005 - 2MM SOCKET STRIPS; Supplier 1: Newark; Supplier Part Number 1: 81P8253; Manufacturer: SAMTEC; Manufacturer Part Number: SSQ-106-02-G-D-RA-005; Stock 1: 0; Pricing 1: 1=1.58, 20834=1.4, 41667=1.32 (USD); Value: SSQ-106-02-G-D-RA-005

## Sheet ARDUINO_IO.SchDoc
size B; Organization: Altium Limited; Address1: 3 Minna Close; Address2: Belrose; Address3: NSW 2085; Address4: Australia; SheetNumber: 7; SheetTotal: 7
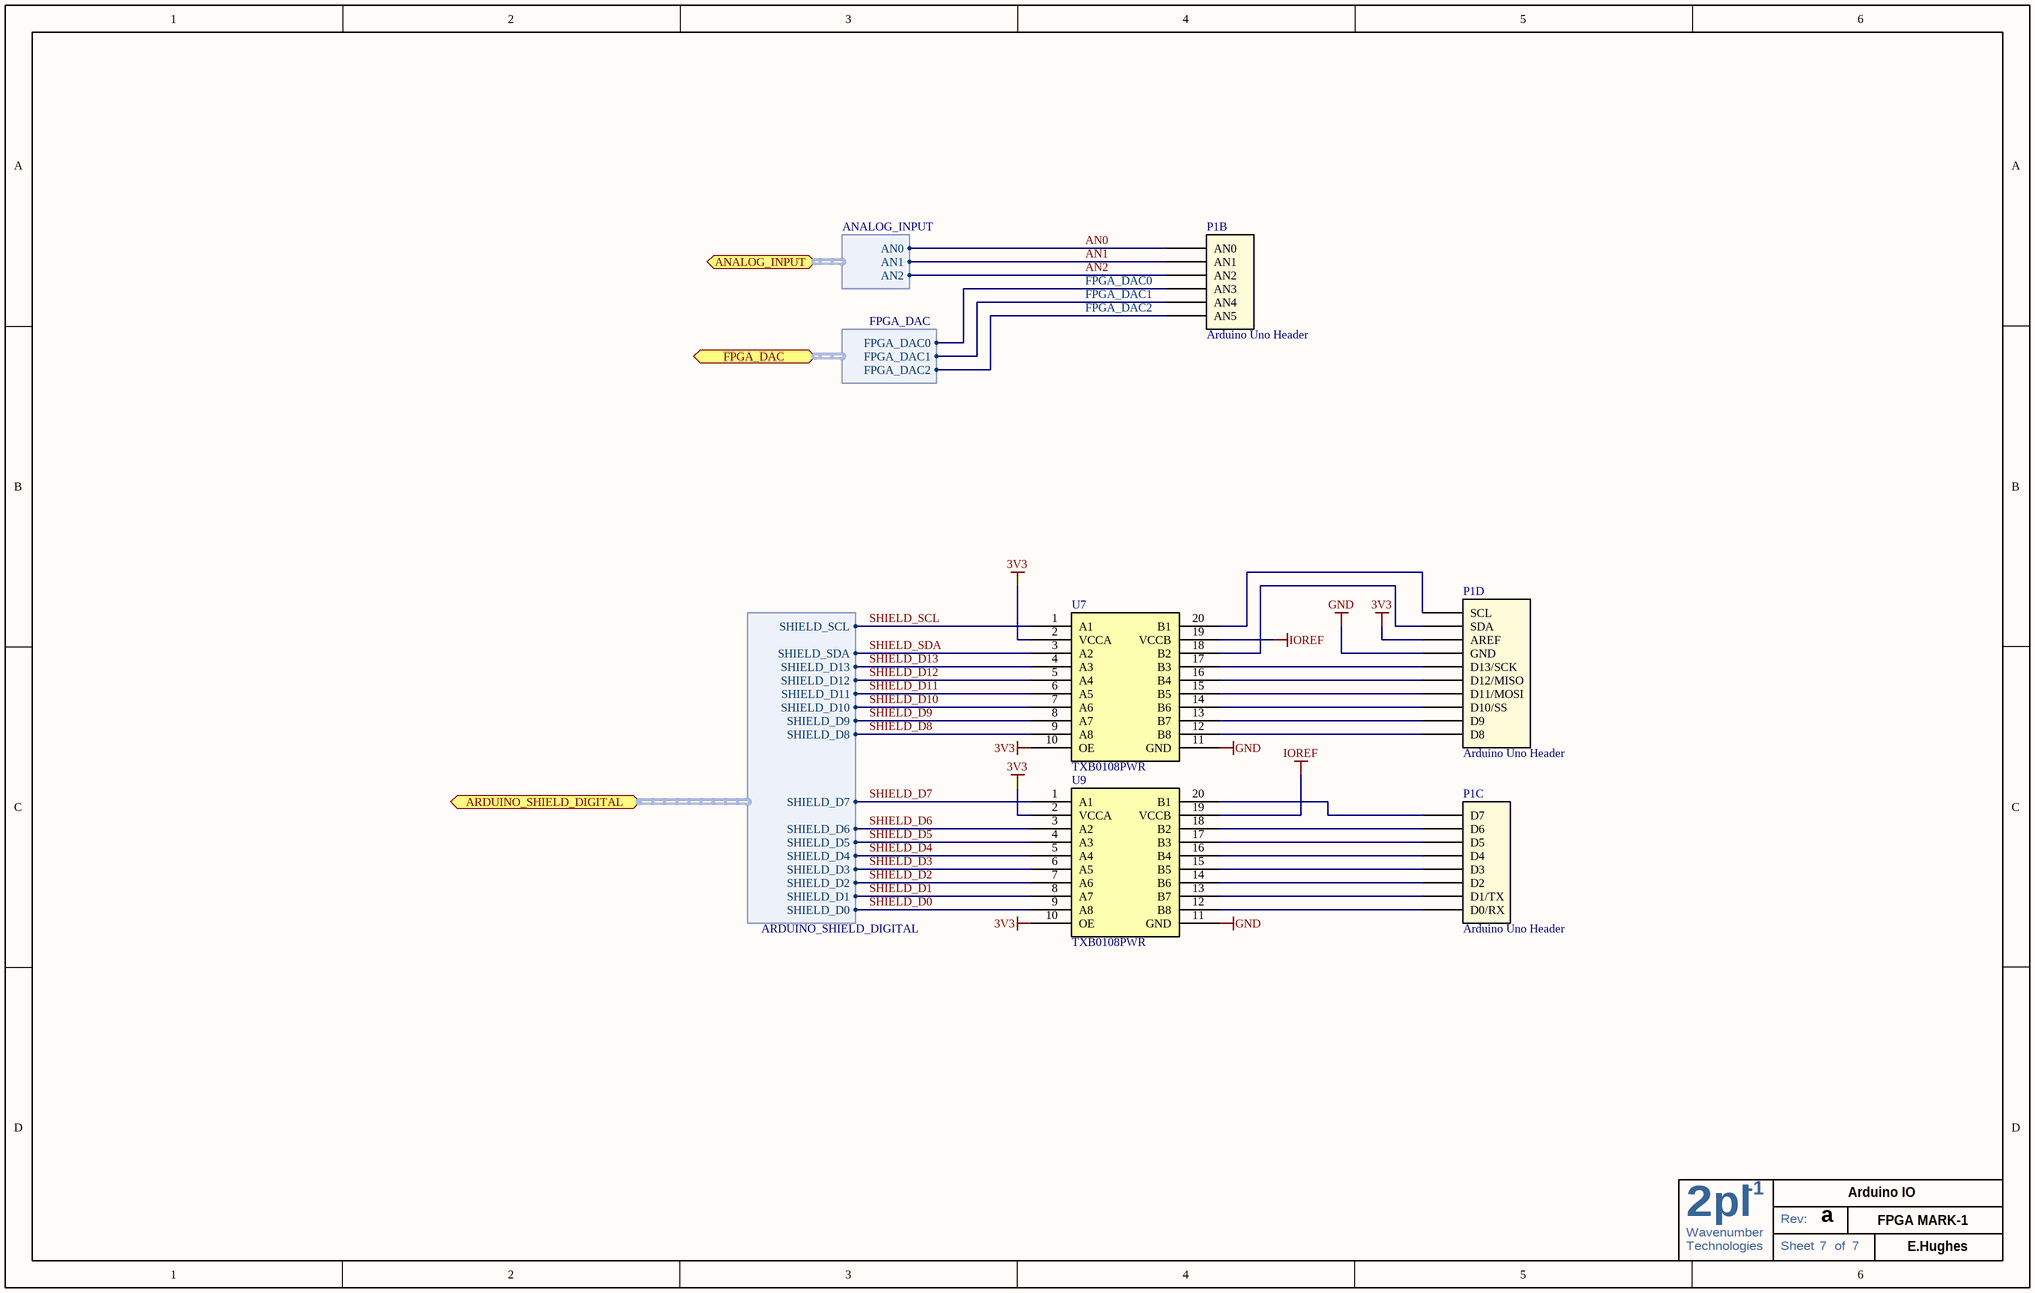
[diagram p3: ARDUINO_IO.SchDoc]

### Parts
P1  Arduino Uno Header  [Arduino Shield - smaller Thru]  (parts B,C,D of 4)
U7  TXB0108PWR  [TSSOP20]
U9  TXB0108PWR  [TSSOP20]

### Ports
ANALOG_INPUT (harness ANALOG_INPUT), ARDUINO_SHIELD_DIGITAL (harness ARDUINO_SHIELD_DIGITAL), FPGA_DAC (harness FPGA_DAC)

### Harnesses
ANALOG_INPUT: AN0, AN1, AN2
FPGA_DAC: FPGA_DAC0, FPGA_DAC1, FPGA_DAC2
ARDUINO_SHIELD_DIGITAL: SHIELD_D13, SHIELD_D12, SHIELD_D11, SHIELD_D10, SHIELD_D9, SHIELD_D8, SHIELD_D7, SHIELD_D6, SHIELD_D5, SHIELD_D4, SHIELD_D3, SHIELD_D2, SHIELD_D1, SHIELD_D0, SHIELD_SDA, SHIELD_SCL

### Nets
3V3: P1.D8(AREF) U7.2(VCCA) U7.10(OE) U9.2(VCCA) U9.10(OE)
GND: P1.D7(GND) U7.11(GND) U9.11(GND)
IOREF: U7.19(VCCB) U9.19(VCCB)
AN0: P1.B1(AN0) ; port ANALOG_INPUT.AN0
AN1: P1.B2(AN1) ; port ANALOG_INPUT.AN1
AN2: P1.B3(AN2) ; port ANALOG_INPUT.AN2
FPGA_DAC0: P1.B4(AN3) ; port FPGA_DAC.FPGA_DAC0
FPGA_DAC1: P1.B5(AN4) ; port FPGA_DAC.FPGA_DAC1
FPGA_DAC2: P1.B6(AN5) ; port FPGA_DAC.FPGA_DAC2
SHIELD_D0: U9.9(A8) ; port ARDUINO_SHIELD_DIGITAL.SHIELD_D0
SHIELD_D1: U9.8(A7) ; port ARDUINO_SHIELD_DIGITAL.SHIELD_D1
SHIELD_D2: U9.7(A6) ; port ARDUINO_SHIELD_DIGITAL.SHIELD_D2
SHIELD_D3: U9.6(A5) ; port ARDUINO_SHIELD_DIGITAL.SHIELD_D3
SHIELD_D4: U9.5(A4) ; port ARDUINO_SHIELD_DIGITAL.SHIELD_D4
SHIELD_D5: U9.4(A3) ; port ARDUINO_SHIELD_DIGITAL.SHIELD_D5
SHIELD_D6: U9.3(A2) ; port ARDUINO_SHIELD_DIGITAL.SHIELD_D6
SHIELD_D7: U9.1(A1) ; port ARDUINO_SHIELD_DIGITAL.SHIELD_D7
SHIELD_D8: U7.9(A8) ; port ARDUINO_SHIELD_DIGITAL.SHIELD_D8
SHIELD_D9: U7.8(A7) ; port ARDUINO_SHIELD_DIGITAL.SHIELD_D9
SHIELD_D10: U7.7(A6) ; port ARDUINO_SHIELD_DIGITAL.SHIELD_D10
SHIELD_D11: U7.6(A5) ; port ARDUINO_SHIELD_DIGITAL.SHIELD_D11
SHIELD_D12: U7.5(A4) ; port ARDUINO_SHIELD_DIGITAL.SHIELD_D12
SHIELD_D13: U7.4(A3) ; port ARDUINO_SHIELD_DIGITAL.SHIELD_D13
SHIELD_SCL: U7.1(A1) ; port ARDUINO_SHIELD_DIGITAL.SHIELD_SCL
SHIELD_SDA: U7.3(A2) ; port ARDUINO_SHIELD_DIGITAL.SHIELD_SDA
NetP1_C1: P1.C1(D0/RX) U9.12(B8)
NetP1_C2: P1.C2(D1/TX) U9.13(B7)
NetP1_C3: P1.C3(D2) U9.14(B6)
NetP1_C4: P1.C4(D3) U9.15(B5)
NetP1_C5: P1.C5(D4) U9.16(B4)
NetP1_C6: P1.C6(D5) U9.17(B3)
NetP1_C7: P1.C7(D6) U9.18(B2)
NetP1_C8: P1.C8(D7) U9.20(B1)
NetP1_D1: P1.D1(D8) U7.12(B8)
NetP1_D2: P1.D2(D9) U7.13(B7)
NetP1_D3: P1.D3(D10/SS) U7.14(B6)
NetP1_D4: P1.D4(D11/MOSI) U7.15(B5)
NetP1_D5: P1.D5(D12/MISO) U7.16(B4)
NetP1_D6: P1.D6(D13/SCK) U7.17(B3)
NetP1_D9: P1.D9(SDA) U7.18(B2)
NetP1_D10: P1.D10(SCL) U7.20(B1)

### Notes on the sheet
- a
- Arduino IO
- FPGA MARK-1
- E.Hughes
- 2
- Wavenumber
- pl
- -1
- Rev:
- Technologies
- Sheet
- of

### Library data of the parts
P1 = Arduino Shield: Arduino Duem Header
U7 U9 = TXB0108PWR: IC 8-BIT TRNSTR 15KV ESD 20TSSOP; Manufacturer: Texas Instruments; Logic Function: Translator, Bidirectional; Number of Bits: 8; Input Type: Logic; Data Rate: 100Mbps; Number of Outputs/Channel: 1; Differential - Input:Output: No/No; Propagation Delay (Max): 4ns; Voltage - Supply: 1.2 V ~ 3.6 V, 1.65 V ~ 5.5 V; Supplier 1: Digi-Key; Supplier Part Number 1: 296-21527-1-ND; Manufacturer Part Number: TXB0108PWR; RoHS: RoHS Compliant; Category: Integrated Circuits (ICs); Stock 1: 12532; Pricing 1: 1=2.8, 25=2.16, 100=1.96, 250=1.76, 500=1.52, 1000=1.28 (USD); Output Type: Logic; Number of Channels: 8; Operating Temperature: -40°C ~ 85°C; Package / Case: 20-TSSOP (0.173", 4.40mm Width); Supplier Device Package: 20-TSSOP; Packaging: Cut Tape (CT); ComponentLink1URL: http://www.ti.com/lit/ds/symlink/txb0108.pdf; ComponentLink1Description: http://www.ti.com/lit/ds/symlink/txb0108.pdf; Value: TXB0108PWR

## Nets that join several sheets
3V3: LOGIC_FPGA (C33.2 U10.1 U10.4), FPGA_POWER_AND_CONFIGURATION (48 pins), PMOD_IO (12 pins), ARDUINO_IO (5 pins)
GND: LOGIC_FPGA (5 pins), FPGA_POWER_AND_CONFIGURATION (52 pins), PMOD_IO (12 pins), ARDUINO_IO (P1.D7 U7.11 U9.11)
FPGA_DAC0: LOGIC_FPGA (C41.1 R37.1), ARDUINO_IO (P1.B4)
FPGA_DAC1: LOGIC_FPGA (C43.1 R39.1), ARDUINO_IO (P1.B5)
FPGA_DAC2: LOGIC_FPGA (C44.1 R42.1), ARDUINO_IO (P1.B6)
PMOD1_1: LOGIC_FPGA (U8.127), PMOD_IO (J4.1)
PMOD1_2: LOGIC_FPGA (U8.126), PMOD_IO (J4.2)
PMOD1_3: LOGIC_FPGA (U8.124), PMOD_IO (J4.3)
PMOD1_4: LOGIC_FPGA (U8.123), PMOD_IO (J4.4)
PMOD1_7: LOGIC_FPGA (U8.121), PMOD_IO (J4.7)
PMOD1_8: LOGIC_FPGA (U8.120), PMOD_IO (J4.8)
PMOD1_9: LOGIC_FPGA (U8.119), PMOD_IO (J4.9)
PMOD1_10: LOGIC_FPGA (U8.118), PMOD_IO (J4.10)
PMOD2_1: LOGIC_FPGA (U8.117), PMOD_IO (J7.1)
PMOD2_2: LOGIC_FPGA (U8.116), PMOD_IO (J7.2)
PMOD2_3: LOGIC_FPGA (U8.115), PMOD_IO (J7.3)
PMOD2_4: LOGIC_FPGA (U8.114), PMOD_IO (J7.4)
PMOD2_7: LOGIC_FPGA (U8.112), PMOD_IO (J7.7)
PMOD2_8: LOGIC_FPGA (U8.111), PMOD_IO (J7.8)
PMOD2_9: LOGIC_FPGA (U8.105), PMOD_IO (J7.9)
PMOD2_10: LOGIC_FPGA (U8.104), PMOD_IO (J7.10)
PMOD3_1: LOGIC_FPGA (U8.102), PMOD_IO (J8.1)
PMOD3_2: LOGIC_FPGA (U8.101), PMOD_IO (J8.2)
PMOD3_3: LOGIC_FPGA (U8.100), PMOD_IO (J8.3)
PMOD3_4: LOGIC_FPGA (U8.99), PMOD_IO (J8.4)
PMOD3_7: LOGIC_FPGA (U8.98), PMOD_IO (J8.7)
PMOD3_8: LOGIC_FPGA (U8.97), PMOD_IO (J8.8)
PMOD3_9: LOGIC_FPGA (U8.95), PMOD_IO (J8.9)
PMOD3_10: LOGIC_FPGA (U8.94), PMOD_IO (J8.10)
PMOD4_1: LOGIC_FPGA (U8.93), PMOD_IO (J9.1)
PMOD4_2: LOGIC_FPGA (U8.92), PMOD_IO (J9.2)
PMOD4_3: LOGIC_FPGA (U8.88), PMOD_IO (J9.3)
PMOD4_4: LOGIC_FPGA (U8.87), PMOD_IO (J9.4)
PMOD4_7: LOGIC_FPGA (U8.85), PMOD_IO (J9.7)
PMOD4_8: LOGIC_FPGA (U8.84), PMOD_IO (J9.8)
PMOD4_9: LOGIC_FPGA (U8.83), PMOD_IO (J9.9)
PMOD4_10: LOGIC_FPGA (U8.82), PMOD_IO (J9.10)
PMOD5_1: LOGIC_FPGA (U8.81), PMOD_IO (J13.1)
PMOD5_2: LOGIC_FPGA (U8.80), PMOD_IO (J13.2)
PMOD5_3: LOGIC_FPGA (U8.79), PMOD_IO (J13.3)
PMOD5_4: LOGIC_FPGA (U8.78), PMOD_IO (J13.4)
PMOD5_7: LOGIC_FPGA (U8.75), PMOD_IO (J13.7)
PMOD5_8: LOGIC_FPGA (U8.67), PMOD_IO (J13.8)
PMOD5_9: LOGIC_FPGA (U8.66), PMOD_IO (J13.9)
PMOD5_10: LOGIC_FPGA (U8.62), PMOD_IO (J13.10)
SHIELD_D0: LOGIC_FPGA (U8.35), ARDUINO_IO (U9.9)
SHIELD_D1: LOGIC_FPGA (U8.34), ARDUINO_IO (U9.8)
SHIELD_D2: LOGIC_FPGA (U8.33), ARDUINO_IO (U9.7)
SHIELD_D3: LOGIC_FPGA (U8.32), ARDUINO_IO (U9.6)
SHIELD_D4: LOGIC_FPGA (U8.30), ARDUINO_IO (U9.5)
SHIELD_D5: LOGIC_FPGA (U8.29), ARDUINO_IO (U9.4)
SHIELD_D6: LOGIC_FPGA (U8.27), ARDUINO_IO (U9.3)
SHIELD_D7: LOGIC_FPGA (U8.26), ARDUINO_IO (U9.1)
SHIELD_D8: LOGIC_FPGA (U8.24), ARDUINO_IO (U7.9)
SHIELD_D9: LOGIC_FPGA (U8.23), ARDUINO_IO (U7.8)
SHIELD_D10: LOGIC_FPGA (U8.22), ARDUINO_IO (U7.7)
SHIELD_D11: LOGIC_FPGA (U8.21), ARDUINO_IO (U7.6)
SHIELD_D12: LOGIC_FPGA (U8.17), ARDUINO_IO (U7.5)
SHIELD_D13: LOGIC_FPGA (U8.16), ARDUINO_IO (U7.4)
SHIELD_SCL: LOGIC_FPGA (U8.14), ARDUINO_IO (U7.1)
SHIELD_SDA: LOGIC_FPGA (U8.15), ARDUINO_IO (U7.3)

## Assembly variants
NO_THRU-HOLE: not fitted C45 D6 DC5 DC6 DC7 DC10 DC11 DC14 DC15 DC16 J2 J4 J5 J6 J7 J8 J9 J12 J13 P1 U11
PMODS: not fitted D6 J2 J5 J6 P1 U11; alternate parts J13 -> =Value, J12 -> =Value, J7 -> =Value, J8 -> =Value, J9 -> =Value